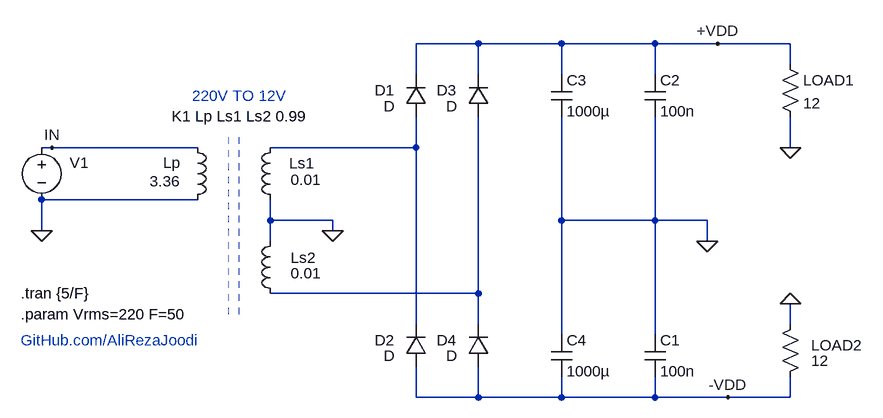
[diagram p0: schematic v1.0.asc]
v1.0.asc, the LTspice schematic file:
Version 4.1
SHEET 1 1736 680
WIRE 416 0 320 0
WIRE 544 0 416 0
WIRE 688 0 544 0
WIRE 784 0 688 0
WIRE 896 0 784 0
WIRE 896 32 896 0
WIRE 320 48 320 0
WIRE 416 48 416 0
WIRE 544 48 544 0
WIRE 688 48 688 0
WIRE -240 160 -256 160
WIRE -16 160 -240 160
WIRE 320 160 320 112
WIRE 320 160 96 160
WIRE 896 160 896 112
WIRE -16 240 -256 240
WIRE 96 272 96 240
WIRE 192 272 96 272
WIRE 544 272 544 112
WIRE 688 272 688 112
WIRE 688 272 544 272
WIRE 768 272 688 272
WIRE -256 288 -256 240
WIRE 192 288 192 272
WIRE 96 304 96 272
WIRE 768 304 768 272
WIRE 416 384 416 112
WIRE 416 384 96 384
WIRE 320 432 320 160
WIRE 416 432 416 384
WIRE 896 432 896 400
WIRE 544 448 544 272
WIRE 688 448 688 272
WIRE 320 544 320 496
WIRE 416 544 416 496
WIRE 416 544 320 544
WIRE 544 544 544 512
WIRE 544 544 416 544
WIRE 688 544 688 512
WIRE 688 544 544 544
WIRE 800 544 688 544
WIRE 896 544 896 512
WIRE 896 544 800 544
FLAG 784 0 +VDD
FLAG 896 160 0
FLAG -256 288 0
FLAG -240 160 IN
FLAG 800 544 -VDD
FLAG 768 304 0
FLAG 896 400 0
FLAG 192 288 0
SYMBOL voltage -256 144 R0
WINDOW 0 43 39 Left 2
WINDOW 3 -248 72 Invisible 2
WINDOW 123 0 0 Left 0
WINDOW 39 -162 108 Left 2
SYMATTR InstName V1
SYMATTR Value SINE(0 {Vrms*1.414} {F})
SYMBOL diode 336 112 R180
WINDOW 0 49 40 Left 2
WINDOW 3 48 16 Left 2
SYMATTR InstName D1
SYMBOL cap 672 48 R0
SYMATTR InstName C2
SYMATTR Value 100n
SYMBOL cap 528 48 R0
SYMATTR InstName C3
SYMATTR Value 1000µ
SYMBOL ind -32 256 M180
WINDOW 0 -37 73 Left 2
WINDOW 3 -58 44 Left 2
SYMATTR InstName Lp
SYMATTR Value 3.36
SYMATTR Type ind
SYMATTR SpiceLine Ipk=0.2 Rser=82 Rpar=48k
SYMBOL ind 112 256 R180
WINDOW 0 -52 72 Left 2
WINDOW 3 -15 47 Right 2
SYMATTR InstName Ls1
SYMATTR Value 0.01
SYMATTR Type ind
SYMATTR SpiceLine Ipk=3 Rser=0.3
SYMBOL ind 112 400 R180
WINDOW 0 -54 71 Left 2
WINDOW 3 -15 47 Right 2
SYMATTR InstName Ls2
SYMATTR Value 0.01
SYMATTR Type ind
SYMATTR SpiceLine Ipk=3 Rser=0.3
SYMBOL diode 336 496 R180
WINDOW 0 49 40 Left 2
WINDOW 3 48 16 Left 2
SYMATTR InstName D2
SYMBOL diode 432 112 R180
WINDOW 0 49 40 Left 2
WINDOW 3 48 16 Left 2
SYMATTR InstName D3
SYMBOL diode 432 496 R180
WINDOW 0 49 40 Left 2
WINDOW 3 48 16 Left 2
SYMATTR InstName D4
SYMBOL cap 672 448 R0
SYMATTR InstName C1
SYMATTR Value 100n
SYMBOL cap 528 448 R0
SYMATTR InstName C4
SYMATTR Value 1000µ
SYMBOL res 880 16 R0
SYMATTR InstName LOAD1
SYMATTR Value 12
SYMBOL res 880 528 M180
WINDOW 0 48 64 Left 2
WINDOW 3 48 40 Left 2
SYMATTR InstName LOAD2
SYMATTR Value 12
TEXT -288 384 Left 2 !.tran {5/F}
TEXT -56 112 Left 2 !K1 Lp Ls1 Ls2 0.99
TEXT -24 80 Left 2 ;220V TO 12V
TEXT -288 416 Left 2 !.param Vrms=220 F=50
TEXT -288 456 Left 2 ;GitHub.com/AliRezaJoodi
LINE Normal 32 416 32 144 2
LINE Normal 32 416 32 144 2
LINE Normal 48 416 48 144 2

The netlist it stands for:
* v1.0.asc
V1 IN 0 SINE(0 {Vrms*1.414} {F})
D1 N001 +VDD D
C2 +VDD 0 100n
C3 +VDD 0 1000µ
Lp 0 IN 3.36 Ipk=0.2 Rser=82 Rpar=48k
Ls1 0 N001 0.01 Ipk=3 Rser=0.3
Ls2 N002 0 0.01 Ipk=3 Rser=0.3
D2 -VDD N001 D
D3 N002 +VDD D
D4 -VDD N002 D
C1 0 -VDD 100n
C4 0 -VDD 1000µ
R§LOAD1 +VDD 0 12
R§LOAD2 -VDD 0 12
.model D D
.lib standard.dio
.tran {5/F}
K1 Lp Ls1 Ls2 0.99
* 220V TO 12V
.param Vrms=220 F=50
* GitHub.com/AliRezaJoodi
.backanno
.end